# Altium schematic sheet pca20020_sheet2_mcu.SchDoc: PCA20020 - nRF MCU
size A4; Organization: Nordic Semiconductor; DocumentNumber: 2; SheetNumber: 2; SheetTotal: 9; CompanyName: Nordic Semiconductor; DocumentSize: A4
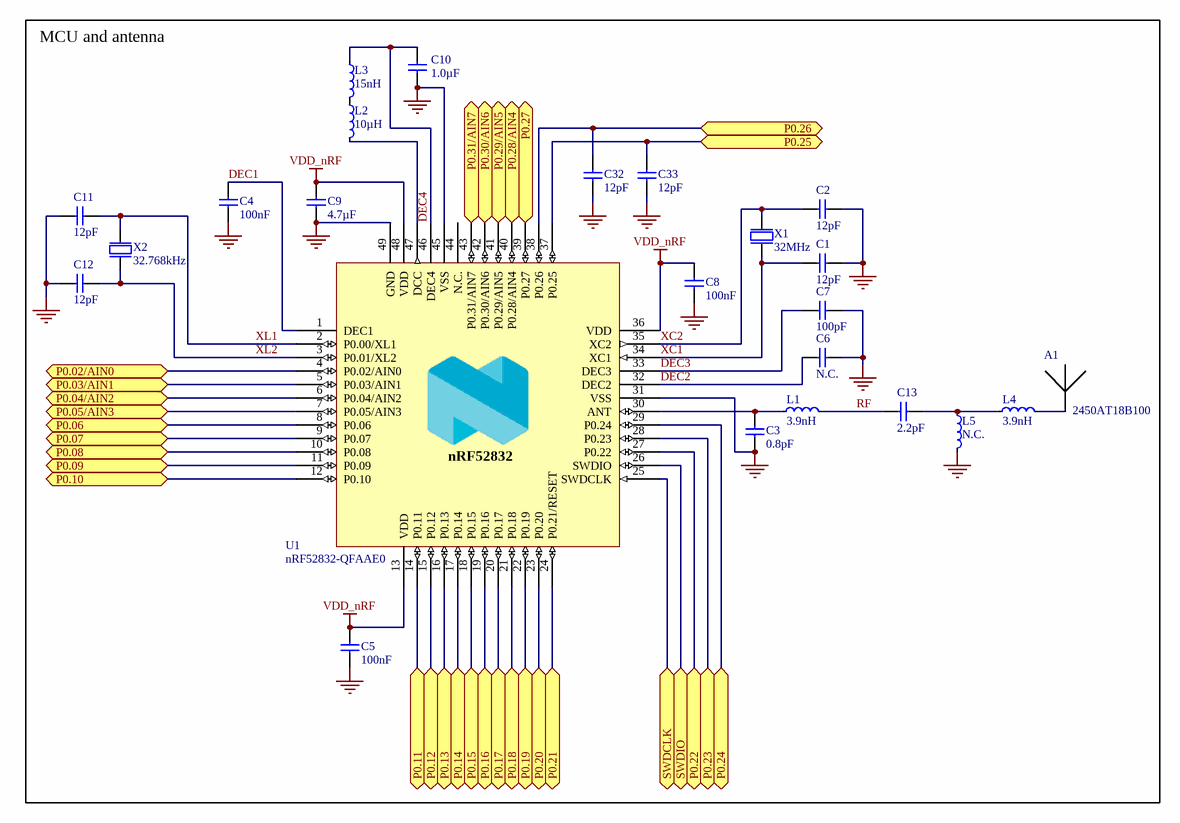
[diagram p0: pca20020_sheet2_mcu.SchDoc]

## Parts
A1  2450AT18B100  [2450AT18B100]
C1  12pF  [CAPC1005X04L]
C2  12pF  [CAPC1005X04L]
C3  0.8pF  [CAPC1005X04L]
C4  100nF  [CAPC1005X04L]
C5  100nF  [CAPC1005X04L]
C6  N.C.  [CAPC1005X04L]
C7  100pF  [CAPC1005X04L]
C8  100nF  [CAPC1005X04L]
C9  4.7µF  [CAPC1608X06L]
C10  1.0µF  [CAPC1608X06L]
C11  12pF  [CAPC1005X04L]
C12  12pF  [CAPC1005X04L]
C13  2.2pF  [CAPC1005X04L]
C32  12pF  [CAPC1005X04L]
C33  12pF  [CAPC1005X04L]
L1  3.9nH  [INDC1005X04L]
L2  10µH  [INDC1608X06L]
L3  15nH  [INDC1005X04L]
L4  3.9nH  [INDC1005X04L]
L5  N.C.  [INDC1005X04L]
U1  nRF52832-QFAAE0  [QFN40P600X600X90-48N]
X1  32MHz  [BT-XTAL_2016]
X2  32.768kHz  [XTAL_2012]

## Blocks framed on the sheet
MCU and antenna: A1 C1-C13 C32 C33 L1-L5 U1 X1 X2

## Ports
P0.02/AIN0 (bidir), P0.03/AIN1 (bidir), P0.04/AIN2 (bidir), P0.05/AIN3 (bidir), P0.06 (bidir), P0.07 (bidir), P0.08 (bidir), P0.09 (bidir), P0.10 (bidir), P0.11 (bidir), P0.12 (bidir), P0.13 (bidir), P0.14 (bidir), P0.15 (bidir), P0.16 (bidir), P0.17 (bidir), P0.18 (bidir), P0.19 (bidir), P0.20 (bidir), P0.21 (bidir), P0.22 (bidir), P0.23 (bidir), P0.24 (bidir), P0.25 (bidir), P0.26 (bidir), P0.27 (bidir), P0.28/AIN4 (bidir), P0.29/AIN5 (bidir), P0.30/AIN6 (bidir), P0.31/AIN7 (bidir), SWDCLK (bidir), SWDIO (bidir)

## Nets
GND: C1.2 C2.2 C3.1 C4.2 C5.2 C6.1 C7.2 C8.2 C9.2 C10.1 C11.2 C12.2 C32.1 C33.1 L5.2 U1.31(VSS) U1.45(VSS) U1.49(GND) X1.2(GND) X1.4(GND)
VDD_nRF: C5.1 C8.1 C9.1 U1.13(VDD) U1.36(VDD) U1.48(VDD)
DEC1: C4.1 U1.1(DEC1)
DEC2: C6.2 U1.32(DEC2)
DEC3: C7.1 U1.33(DEC3)
DEC4: C10.2 L3.1 U1.46(DEC4)
P0.02/AIN0: U1.4(P0.02/AIN0) ; port P0.02/AIN0
P0.03/AIN1: U1.5(P0.03/AIN1) ; port P0.03/AIN1
P0.04/AIN2: U1.6(P0.04/AIN2) ; port P0.04/AIN2
P0.05/AIN3: U1.7(P0.05/AIN3) ; port P0.05/AIN3
P0.06: U1.8(P0.06) ; port P0.06
P0.07: U1.9(P0.07) ; port P0.07
P0.08: U1.10(P0.08) ; port P0.08
P0.09: U1.11(P0.09) ; port P0.09
P0.10: U1.12(P0.10) ; port P0.10
P0.11: U1.14(P0.11) ; port P0.11
P0.12: U1.15(P0.12) ; port P0.12
P0.13: U1.16(P0.13) ; port P0.13
P0.14: U1.17(P0.14) ; port P0.14
P0.15: U1.18(P0.15) ; port P0.15
P0.16: U1.19(P0.16) ; port P0.16
P0.17: U1.20(P0.17) ; port P0.17
P0.18: U1.21(P0.18) ; port P0.18
P0.19: U1.22(P0.19) ; port P0.19
P0.20: U1.23(P0.20) ; port P0.20
P0.21: U1.24(P0.21/RESET) ; port P0.21
P0.22: U1.27(P0.22) ; port P0.22
P0.23: U1.28(P0.23) ; port P0.23
P0.24: U1.29(P0.24) ; port P0.24
P0.25: C33.2 U1.37(P0.25) ; port P0.25
P0.26: C32.2 U1.38(P0.26) ; port P0.26
P0.27: U1.39(P0.27) ; port P0.27
P0.28/AIN4: U1.40(P0.28/AIN4) ; port P0.28/AIN4
P0.29/AIN5: U1.41(P0.29/AIN5) ; port P0.29/AIN5
P0.30/AIN6: U1.42(P0.30/AIN6) ; port P0.30/AIN6
P0.31/AIN7: U1.43(P0.31/AIN7) ; port P0.31/AIN7
RF: C13.2 L1.2
SWDCLK: U1.25(SWDCLK) ; port SWDCLK
SWDIO: U1.26(SWDIO) ; port SWDIO
XC1: C1.1 U1.34(XC1) X1.1(inp)
XC2: C2.1 U1.35(XC2) X1.3(out)
XL1: C11.1 U1.2(P0.00/XL1) X2.1(inp)
XL2: C12.1 U1.3(P0.01/XL2) X2.2(out)
NetA1_1: A1.1 L4.2
NetC3_2: C3.2 L1.1 U1.30(ANT)
NetC13_1: C13.1 L4.1 L5.1
NetL2_1: L2.1 L3.2
NetL2_2: L2.2 U1.47(DCC)

Not connected (* = marked no-connect by the designer): U1 44(N.C.)

## Notes on the sheet
- Title
- Size
- Date:
- A4
- Project Number
- Sheet         of
- Revision
- File:
- Drawn By:
- (in symbol nRF52832-QFAAE0) nRF52832

## Library data of the parts
A1 = Johanson 2450AT18B100: 2.45 GHz chip antenna; Manufacturer: Johanson Technology; Part number IPS: 00000007781; Artikkelnr Noca: N.A.; Part Number: Johanson 2450AT18B100; Manufacturer Part Number: 2450AT18B100; Footprint Doc: 2450AT18B100; LatestRevisionDate: 2013-09-13; Pin Count: 2; Publisher: Nordic Semiconductor; Published: 2013-09-13; Value: 2450AT18B100; Note: *; ComponentLink1URL: *; ComponentLink1Description: Datasheet; ComponentLink2URL: *; ComponentLink2Description: Supplier link; HelpURL: http://www.johansontechnology.com/datasheets/antennas/2450AT18B100.pdf; Supplier 1: Digi-Key; Supplier Part Number 1: 712-1006-1-ND; Supplier 2: *; Supplier Part Number 2: *
C1 C2 C11 C12 C32 C33 = C0402-12p: Capacitor, NP0, ±2%; Part number IPS: 00000002398; Note: 50V; Artikkelnr Noca: 20029159; Part Number: C0402-12p; Manufacturer: *; Manufacturer Part Number: *; LatestRevisionDate: 2011-05-11; Pin Count: 2; Publisher: Nordic Semiconductor; Published: 2009-05-08; Value: 12pF; Footprint Doc: 0402; ComponentLink1URL: *; ComponentLink1Description: Datasheet; ComponentLink2URL: *; ComponentLink2Description: Supplier link; HelpURL: *; Supplier 1: *; Supplier Part Number 1: *; Supplier 2: *; Supplier Part Number 2: *
C3 = C0402-0.8p: Capacitor, NP0, ±5%; Part number IPS: 00000007782; Note: 50V; Artikkelnr Noca: 20029147; Part Number: C0402-0.8p; Manufacturer: *; Manufacturer Part Number: *; LatestRevisionDate: 2012-11-21; Pin Count: 2; Publisher: Nordic Semiconductor; Published: 2009-05-08; Value: 0.8pF; Footprint Doc: 0402; ComponentLink1URL: *; ComponentLink1Description: Datasheet; ComponentLink2URL: *; ComponentLink2Description: Supplier link; HelpURL: *; Supplier 1: *; Supplier Part Number 1: *; Supplier 2: *; Supplier Part Number 2: *
C4 C5 C8 = C0402-100n: Capacitor, X7R, ±10%; Part number IPS: 00000005296; Note: 16V; Artikkelnr Noca: 20039200; Part Number: C0402-100n; Manufacturer: *; Manufacturer Part Number: *; LatestRevisionDate: 2009-11-23; Pin Count: 2; Publisher: Nordic Semiconductor; Published: 2009-05-08; Value: 100nF; Footprint Doc: 0402; ComponentLink1URL: *; ComponentLink1Description: Datasheet; ComponentLink2URL: *; ComponentLink2Description: Supplier link; HelpURL: *; Supplier 1: *; Supplier Part Number 1: *; Supplier 2: *; Supplier Part Number 2: *
C6 = C0402-N.C.: Not mounted; Note: Chip Cap; Artikkelnr Noca: N.A.; Assembly: Not mounted; Part Number: C0402-N.C.; Manufacturer: *; Manufacturer Part Number: *; LatestRevisionDate: 2009-05-08; Pin Count: 2; Publisher: Nordic Semiconductor; Published: 2009-05-08; Value: N.C.; Footprint Doc: 0402; Part number IPS: N.A.; ComponentLink1URL: *; ComponentLink1Description: Datasheet; ComponentLink2URL: *; ComponentLink2Description: Supplier link; HelpURL: *; Supplier 1: *; Supplier Part Number 1: *; Supplier 2: *; Supplier Part Number 2: *
C7 = C0402-100p: Capacitor, NP0, ±5%; Part number IPS: 00000002361; Note: 50V; Artikkelnr Noca: 20029135; Part Number: C0402-100p; Manufacturer: *; Manufacturer Part Number: *; LatestRevisionDate: 2009-05-08; Pin Count: 2; Publisher: Nordic Semiconductor; Published: 2009-05-08; Value: 100pF; Footprint Doc: 0402; ComponentLink1URL: *; ComponentLink1Description: Datasheet; ComponentLink2URL: *; ComponentLink2Description: Supplier link; HelpURL: *; Supplier 1: *; Supplier Part Number 1: *; Supplier 2: *; Supplier Part Number 2: *
C9 = C0603-4µ7: Capacitor, X5R, ±10%; Part number IPS: 00000007783; Note: 6.3V; Artikkelnr Noca: 20069060; Part Number: C0603-4µ7; Manufacturer: *; Manufacturer Part Number: *; LatestRevisionDate: 2009-11-23; Pin Count: 2; Publisher: Nordic Semiconductor; Published: 2009-05-08; Value: 4.7µF; Footprint Doc: 0603; ComponentLink1URL: *; ComponentLink1Description: Datasheet; ComponentLink2URL: *; ComponentLink2Description: Supplier link; HelpURL: *; Supplier 1: *; Supplier Part Number 1: *; Supplier 2: *; Supplier Part Number 2: *
C10 = C0603-1µ0: Capacitor, X7R, ±10%; Part number IPS: 00000000616; Note: 16V; Artikkelnr Noca: 20039282; Part Number: C0603-1µ0; Manufacturer: *; Manufacturer Part Number: *; LatestRevisionDate: 2013-06-05; Pin Count: 2; Publisher: Nordic Semiconductor; Published: 2009-05-08; Value: 1.0µF; Footprint Doc: 0603; ComponentLink1URL: *; ComponentLink1Description: Datasheet; ComponentLink2URL: *; ComponentLink2Description: Supplier link; HelpURL: *; Supplier 1: *; Supplier Part Number 1: *; Supplier 2: *; Supplier Part Number 2: *
C13 = C0402-2.2p: Capacitor, NP0, ±0.1pF; Part number IPS: 00000003105; Note: 50V; Artikkelnr Noca: 20029145; Part Number: C0402-2.2p; Manufacturer: *; Manufacturer Part Number: *; LatestRevisionDate: 2017-02-23; Pin Count: 2; Publisher: Nordic Semiconductor; Published: 2009-05-08; Value: 2.2pF; Footprint Doc: 0402; ComponentLink1URL: *; ComponentLink1Description: Datasheet; ComponentLink2URL: *; ComponentLink2Description: Supplier link; HelpURL: *; Supplier 1: Digi-Key; Supplier Part Number 1: 490-8092-1-ND; Supplier 2: *; Supplier Part Number 2: *
L1 L4 = L0402-3n9: Inductor, 170mA, ±0.1nH; Manufacturer: Murata; Manufacturer Part Number: LQP15MN3N9B02D; Part number IPS: 00000007793; Note: High frequency chip inductor ±5%; Artikkelnr Noca: 33029151; Part Number: L0402-3n9; LatestRevisionDate: 2012-09-19; Pin Count: 2; Publisher: Nordic Semiconductor; Published: 2009-05-08; Value: 3.9nH; Footprint Doc: 0402; ComponentLink1Description: Datasheet; ComponentLink2Description: Supplier link; ComponentLink1URL: *; ComponentLink2URL: *; HelpURL: http://search.murata.co.jp/Ceramy/image/img/PDF/ENG/L0075S0084LQP15M.pdf; Supplier 1: Digi-Key; Supplier Part Number 1: 490-1131-1-ND; Supplier 2: *; Supplier Part Number 2: *
L2 = L0603-10µ: Inductor, 80mA, ±10%; Manufacturer: Taiyo Yuden; Manufacturer Part Number: LBMF1608T100K; Part number IPS: 00000007794; Note: LBMF1608T100K 10µH 80mA 0603; Artikkelnr Noca: 33029314; Part Number: L0603-10µ; LatestRevisionDate: 2012-09-19; Pin Count: 2; Publisher: Nordic Semiconductor; Published: 2010-02-24; Value: 10µH; Footprint Doc: 0603; ComponentLink1Description: Datasheet; ComponentLink2Description: Supplier link; ComponentLink1URL: *; ComponentLink2URL: *; HelpURL: http://www.yuden.co.jp/ut/product/pdf/elb2_e.pdf; Supplier 1: Digi-Key; Supplier Part Number 1: 587-1714-1-ND; Supplier 2: Farnell; Supplier Part Number 2: 178-6105
L3 = L0402-15n: Inductor, 320mA, ±5%; Manufacturer: Taiyo Yuden; Manufacturer Part Number: HK100515NJ-T; Part number IPS: 00000001262; Note: High frequency chip inductor ±10%; Artikkelnr Noca: 33029323; Part Number: L0402-15n; LatestRevisionDate: 2012-09-19; Pin Count: 2; Publisher: Nordic Semiconductor; Published: 2010-07-12; Value: 15nH; Footprint Doc: 0402; ComponentLink1Description: Datasheet; ComponentLink2Description: Supplier link; ComponentLink1URL: *; ComponentLink2URL: *; HelpURL: http://www.yuden.co.jp/productdata/catalog/en/mlci04_e.pdf; Supplier 1: Digi-Key; Supplier Part Number 1: 587-1521-1-ND; Supplier 2: Farnell; Supplier Part Number 2: 658-1328
L5 = L0402-N.C.: Not mounted; Artikkelnr Noca: N.A.; Assembly: Not mounted; Part Number: L0402-N.C.; Manufacturer: *; Manufacturer Part Number: *; LatestRevisionDate: 2016-11-24; Pin Count: 2; Publisher: Nordic Semiconductor; Published: 2016-11-24; Value: N.C.; Note: *; Footprint Doc: 0402; Part number IPS: N.A.; ComponentLink1Description: Datasheet; ComponentLink2Description: Supplier link; ComponentLink1URL: *; ComponentLink2URL: *; HelpURL: *; Supplier 1: *; Supplier Part Number 1: *; Supplier 2: *; Supplier Part Number 2: *
U1 = nRF52832-QFAAE0: Multi-protocol Bluetooth Low Energy, ANT and 2.4GHz proprietary system-on-chip; Manufacturer: Nordic Semiconductor; Artikkelnr Noca: N.A.; Part Number: nRF52832-QFAAE0; Manufacturer Part Number: nRF52832-QFAAE0; LatestRevisionDate: 2017-10-18; Pin Count: 48; Publisher: Nordic Semiconductor; Published: 2017-10-18; Value: nRF52832-QFAAE0; Note: *; Footprint Doc: QFN-48; Part number IPS: N.A.; ComponentLink1URL: *; ComponentLink1Description: Datasheet; ComponentLink2URL: *; ComponentLink2Description: Supplier link; HelpURL: *; Supplier 1: Nordic Semiconductor; Supplier Part Number 1: nRF52832-QFAAE0; Supplier 2: *; Supplier Part Number 2: *
X1 = XTAL_SMD2016_32MHz_8pF_Kyocera: XTAL SMD 2016, 32MHz, Cl=8pF, Tot: ±40ppm; Manufacturer Part Number: CX2016DB32000D0WZRC1; Part number IPS: 00000007827; Note: XTAL SMD 32.000MHz; Artikkelnr Noca: 22010022; Part Number: XTAL_SMD2016_32MHz_8pF_Kyocera; Manufacturer: Kyocera; LatestRevisionDate: 2016-06-02; Pin Count: 4; Publisher: Nordic Semiconductor; Published: 2015-10-15; Value: 32MHz; Footprint Doc: XTAL_2016; ComponentLink1URL: *; ComponentLink1Description: Datasheet; ComponentLink2URL: *; ComponentLink2Description: Supplier link; HelpURL: http://media.digikey.com/pdf/Data%20Sheets/AVX%20PDFs/CX2016DB32000D0WZRC1_Spec.pdf; Supplier 1: Digi-Key; Supplier Part Number 1: 1253-1586-1-ND; Supplier 2: *; Supplier Part Number 2: *
X2 = XTAL_SMD2012_32.768kHz_9pF_MC: XTAL SMD 2012, 32.768kHz, 9pF, ±20ppm; Manufacturer: Micro Crystal; Manufacturer Part Number: CM8V-T1A 32.768KHZ 9PF +/-20PPM TA QC; Part number IPS: 00000007828; Note: XTAL SMD 32.768kHz; Artikkelnr Noca: N.A.; Part Number: XTAL_SMD2012_32.768kHz_9pF_MC; LatestRevisionDate: 2017-01-30; Pin Count: 2; Publisher: Nordic Semiconductor; Published: 2016-09-15; Value: 32.768kHz; Footprint Doc: XTAL_2012; ComponentLink1URL: *; ComponentLink1Description: Datasheet; ComponentLink2URL: *; ComponentLink2Description: Supplier link; HelpURL: http://www.microcrystal.com/images/_PDF/3_Crystal_Ceramic-Package/cm8v-t1a.pdf; Supplier 1: Allied; Supplier Part Number 1: 70417961; Supplier 2: *; Supplier Part Number 2: *